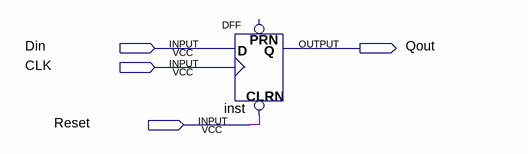
[diagram p0: schematic sheet]
// Quartus schematic SyncDFFwithAsyncRst.bdf as structural Verilog: 1 symbols, 4 pins
module SyncDFFwithAsyncRst (
  input  Din,
  input  CLK,
  input  Reset,
  output Qout
);

  DFF inst (.CLRN(Reset), .CLK(CLK), .D(Din), .Q(Qout));  // open: PRN
endmodule
